# EAGLE schematic rpiSensors (EAGLE 6.2)
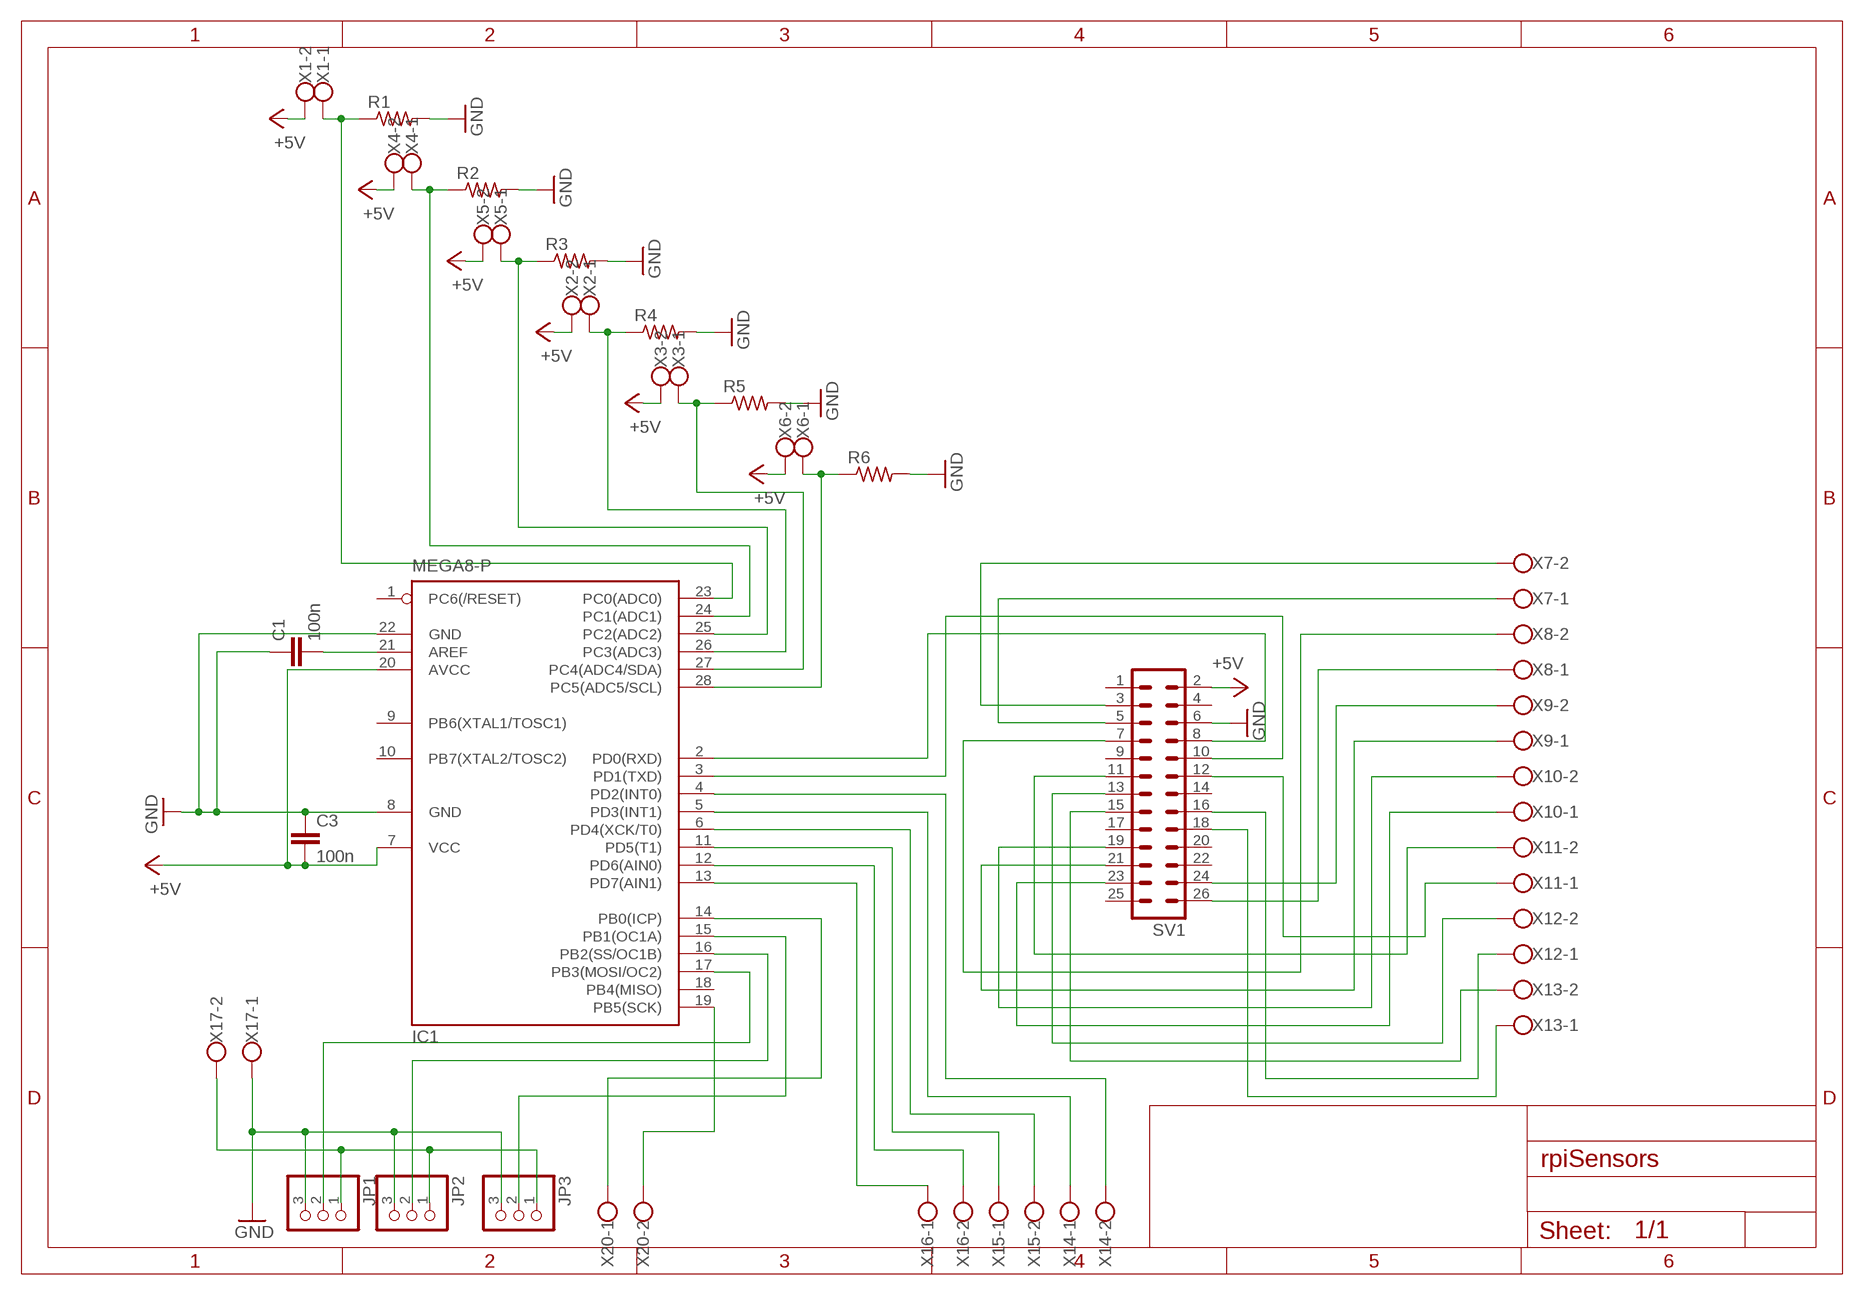
[diagram p0: schematic, sheet 1]

## Parts
C1  100n  C2,5-3  [C2.5-3]
C3  100n  C2,5-3  [C2.5-3]
IC1  MEGA8-P  [DIL28-3]
JP1  PINHD-1X3  [1X03]
JP2  PINHD-1X3  [1X03]
JP3  PINHD-1X3  [1X03]
R1  R-US_0309/12  [0309/12]
R2  R-US_0309/12  [0309/12]
R3  R-US_0309/12  [0309/12]
R4  R-US_0309/12  [0309/12]
R5  R-US_0309/12  [0309/12]
R6  R-US_0309/12  [0309/12]
SV1  ML26  [ML26]
X1  W237-102  [W237-102]
X2  W237-102  [W237-102]
X3  W237-102  [W237-102]
X4  W237-102  [W237-102]
X5  W237-102  [W237-102]
X6  W237-102  [W237-102]
X7  W237-102  [W237-102]
X8  W237-102  [W237-102]
X9  W237-102  [W237-102]
X10  W237-102  [W237-102]
X11  W237-102  [W237-102]
X12  W237-102  [W237-102]
X13  W237-102  [W237-102]
X14  W237-102  [W237-102]
X15  W237-102  [W237-102]
X16  W237-102  [W237-102]
X17  W237-102  [W237-102]
X20  W237-102  [W237-102]

## Nets
+5V: C3.2 IC1.7(VCC) IC1.20(AVCC) SV1.2 X1.2 X2.2 X3.2 X4.2 X5.2 X6.2
GND: C1.1 C3.1 IC1.8(GND) IC1.22(GND) JP1.3 JP2.3 JP3.3 R1.2 R2.2 R3.2 R4.2 R5.2 R6.2 SV1.6 X17.1
N$1: IC1.2(PD0(RXD)) SV1.8
N$2: IC1.3(PD1(TXD)) SV1.10
N$3: IC1.23(PC0(ADC0)) R1.1 X1.1
N$4: IC1.24(PC1(ADC1)) R2.1 X4.1
N$5: IC1.27(PC4(ADC4/SDA)) R5.1 X3.1
N$6: IC1.25(PC2(ADC2)) R3.1 X5.1
N$7: IC1.26(PC3(ADC3)) R4.1 X2.1
N$8: IC1.28(PC5(ADC5/SCL)) R6.1 X6.1
N$9: SV1.3 X7.2
N$10: SV1.5 X7.1
N$11: SV1.7 X8.2
N$12: SV1.26 X8.1
N$13: SV1.24 X9.2
N$14: SV1.21 X9.1
N$15: SV1.19 X10.2
N$16: SV1.23 X10.1
N$17: SV1.11 X11.2
N$18: SV1.12 X11.1
N$19: SV1.13 X12.2
N$20: SV1.15 X13.2
N$21: SV1.16 X12.1
N$22: SV1.18 X13.1
N$23: IC1.17(PB3(MOSI/OC2)) JP1.2
N$24: IC1.16(PB2(SS/OC1B)) JP2.2
N$25: IC1.15(PB1(OC1A)) JP3.2
N$27: IC1.19(PB5(SCK)) X20.2
N$28: IC1.14(PB0(ICP)) X20.1
N$29: IC1.4(PD2(INT0)) X14.2
N$30: IC1.5(PD3(INT1)) X14.1
N$31: IC1.6(PD4(XCK/T0)) X15.2
N$32: IC1.11(PD5(T1)) X15.1
N$33: IC1.12(PD6(AIN0)) X16.2
N$34: IC1.13(PD7(AIN1)) X16.1
N$35: C1.2 IC1.21(AREF)
N$36: JP1.1 JP2.1 JP3.1 X17.2
Unconnected: IC1.1(PC6(/RESET)) IC1.9(PB6(XTAL1/TOSC1)) IC1.10(PB7(XTAL2/TOSC2)) IC1.18(PB4(MISO)) SV1.1 SV1.4 SV1.9 SV1.14 SV1.17 SV1.20 SV1.22 SV1.25

## Library data of the parts
C1 C3 = capacitor-wima:C: CAPACITOR naming: grid - package width
IC1 = atmel:MEGA8-P: MICROCONTROLLER 8 Kbytes FLASH, 1 kbytes SRAM, 512 bytes EEPROM, USART, 4-channel 10 bit ADC, 2-channel 8 bit ADC Pin compatible with Atmega48, ATMega88, ATMega168 Source: avr.lbr; OC_FARNELL: unknown; OC_NEWARK: unknown
JP1-JP3 = pinhead:PINHD-1X3: PIN HEADER
R1-R6 = resistor:R-US_: RESISTOR, American symbol
SV1 = con-harting-ml:ML26: HARTING; OC_FARNELL: unknown; OC_NEWARK: unknown
X1-X17 X20 = con-wago-500:W237-102: WAGO SCREW CLAMP; MPN: 237-102; OC_FARNELL: unknown; OC_NEWARK: 70K9898